# EAGLE design LEDControlSchaltPlan (EAGLE 8.6.0)
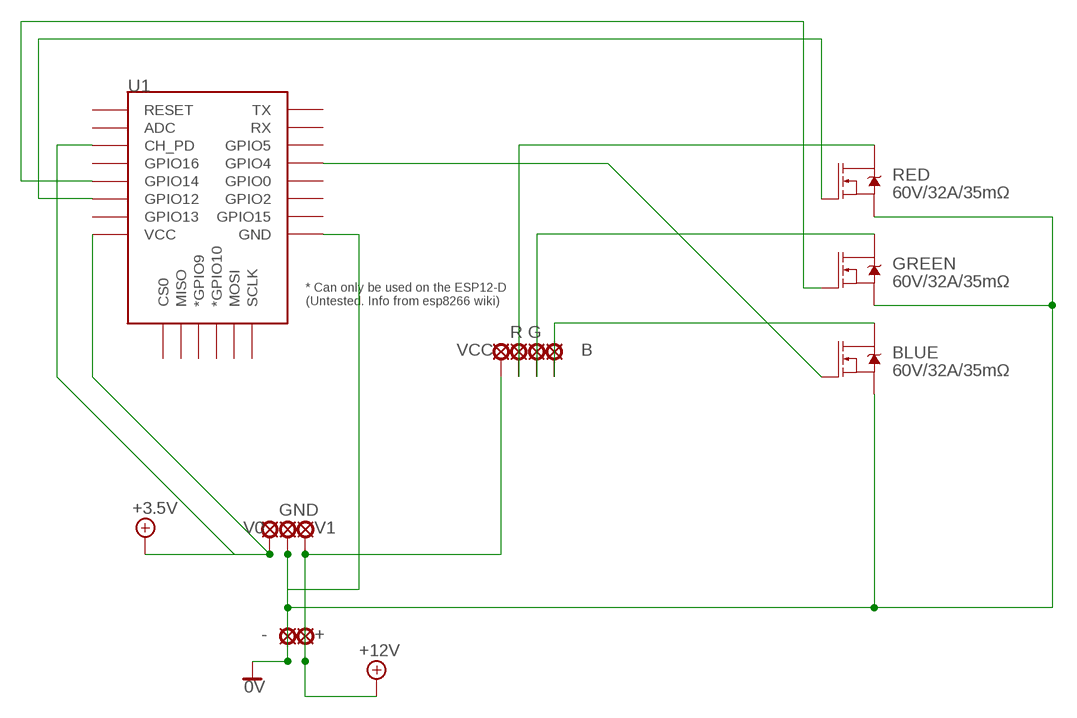
[diagram p0: schematic, sheet 1]

## Parts
+  LSP10  [LSP10]
-  LSP10  [LSP10]
B  LSP10  [LSP10]
BLUE  60V/32A/35mΩ  MOSFET-NCH-FQP30N06L  [TO220V]
G  LSP10  [LSP10]
GND  LSP10  [LSP10]
GREEN  60V/32A/35mΩ  MOSFET-NCH-FQP30N06L  [TO220V]
R  LSP10  [LSP10]
RED  60V/32A/35mΩ  MOSFET-NCH-FQP30N06L  [TO220V]
U1  ESP12ESMD  [ESP12E-SMD]
V0  LSP10  [LSP10]
V1  LSP10  [LSP10]
VCC  LSP10  [LSP10]

## Nets
0V: -.MP BLUE.3(S) GND.MP GREEN.3(S) RED.3(S) U1.GND
+5V: U1.CH_PD U1.VCC V0.MP ; supply symbol labelled +3.5V
+12V: +.MP V1.MP VCC.MP
N$3: RED.1(G) U1.GPIO12
N$4: GREEN.1(G) U1.GPIO14
N$5: BLUE.1(G) U1.GPIO4
N$11: R.MP RED.2(D)
N$12: G.MP GREEN.2(D)
N$13: B.MP BLUE.2(D)
Unconnected: U1.ADC U1.CS0 U1.GPIO0 U1.GPIO2 U1.GPIO5 U1.GPIO9(*GPIO9) U1.GPIO10(*GPIO10) U1.GPIO13 U1.GPIO15 U1.GPIO16 U1.MISO U1.MOSI U1.RESET U1.RXD0(RX) U1.SCLK U1.TXD0(TX)

## Library data of the parts
+ - B G GND R V0 V1 VCC = solpad:LSP10: SOLDER PAD drill 1.0 mm, distributor Buerklin, 12H555
BLUE GREEN RED = SparkFun-DiscreteSemi:MOSFET-NCH: N-channel MOSFETs Voltage controlled devices that allow control of high current outputs. SparkFun Products: SparkFun OpenScale <https://www.sparkfun.com/products/13261> SparkFun Digital Sandbox <https://www.sparkfun.com/products/12651> SparkFun Monster Moto Shield <https://www.sparkfun.com/products/10182> SparkFun MOSFET Power Controller <https://www.sparkfun.com/products/11214>; PROD_ID: TRANS-10060
U1 = esp8266modules:ESP12E: ESP12E Module

## Board
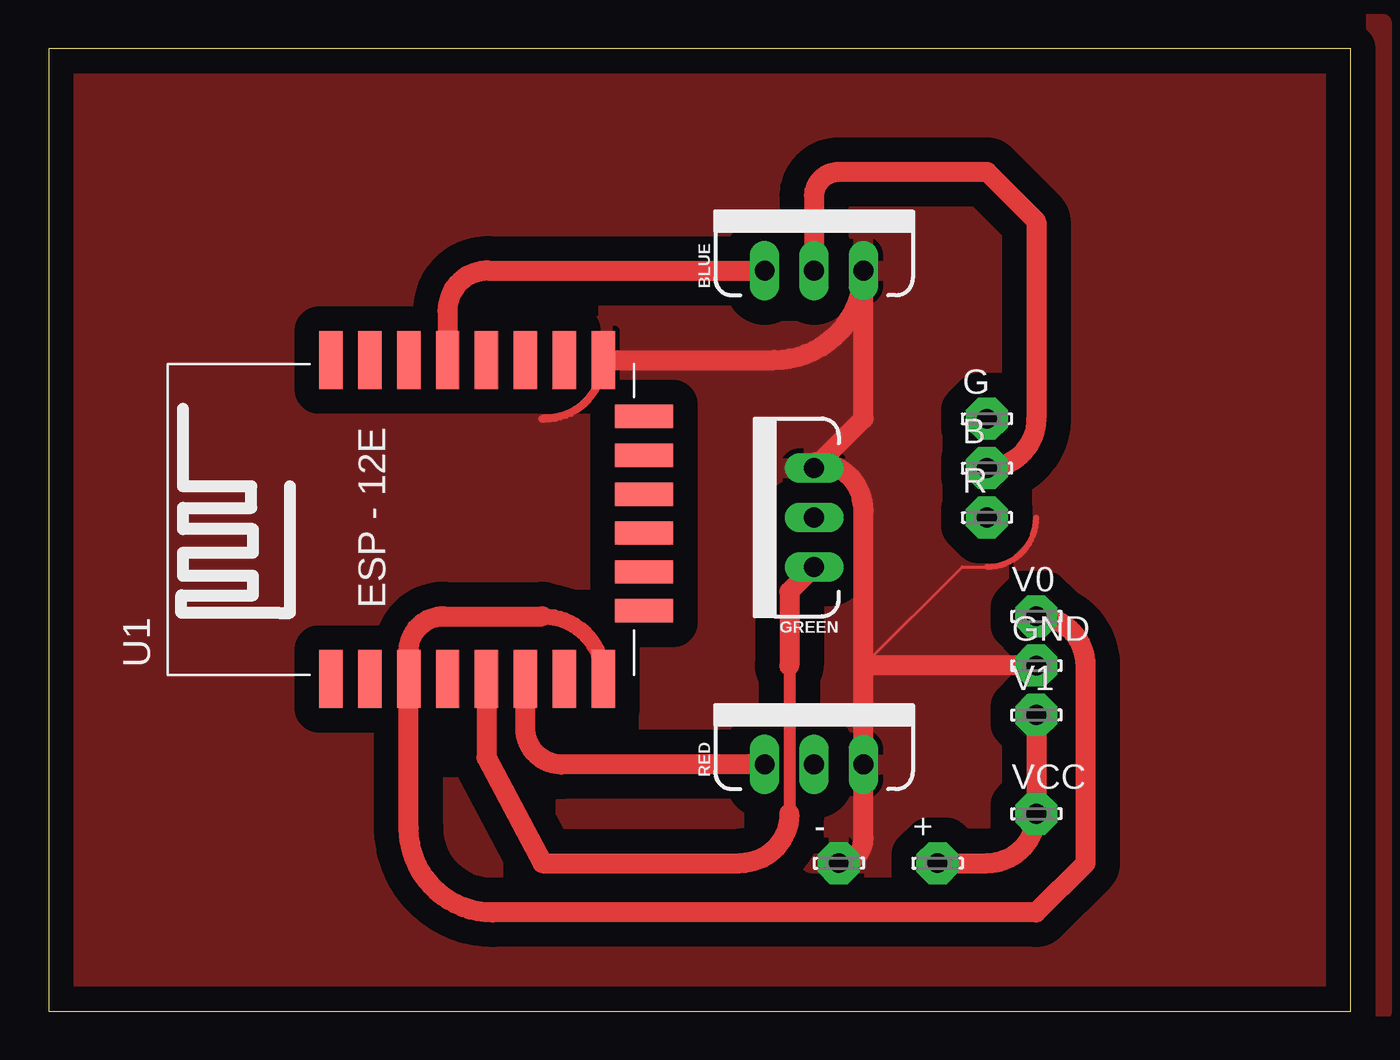
[diagram p1: board, top side]
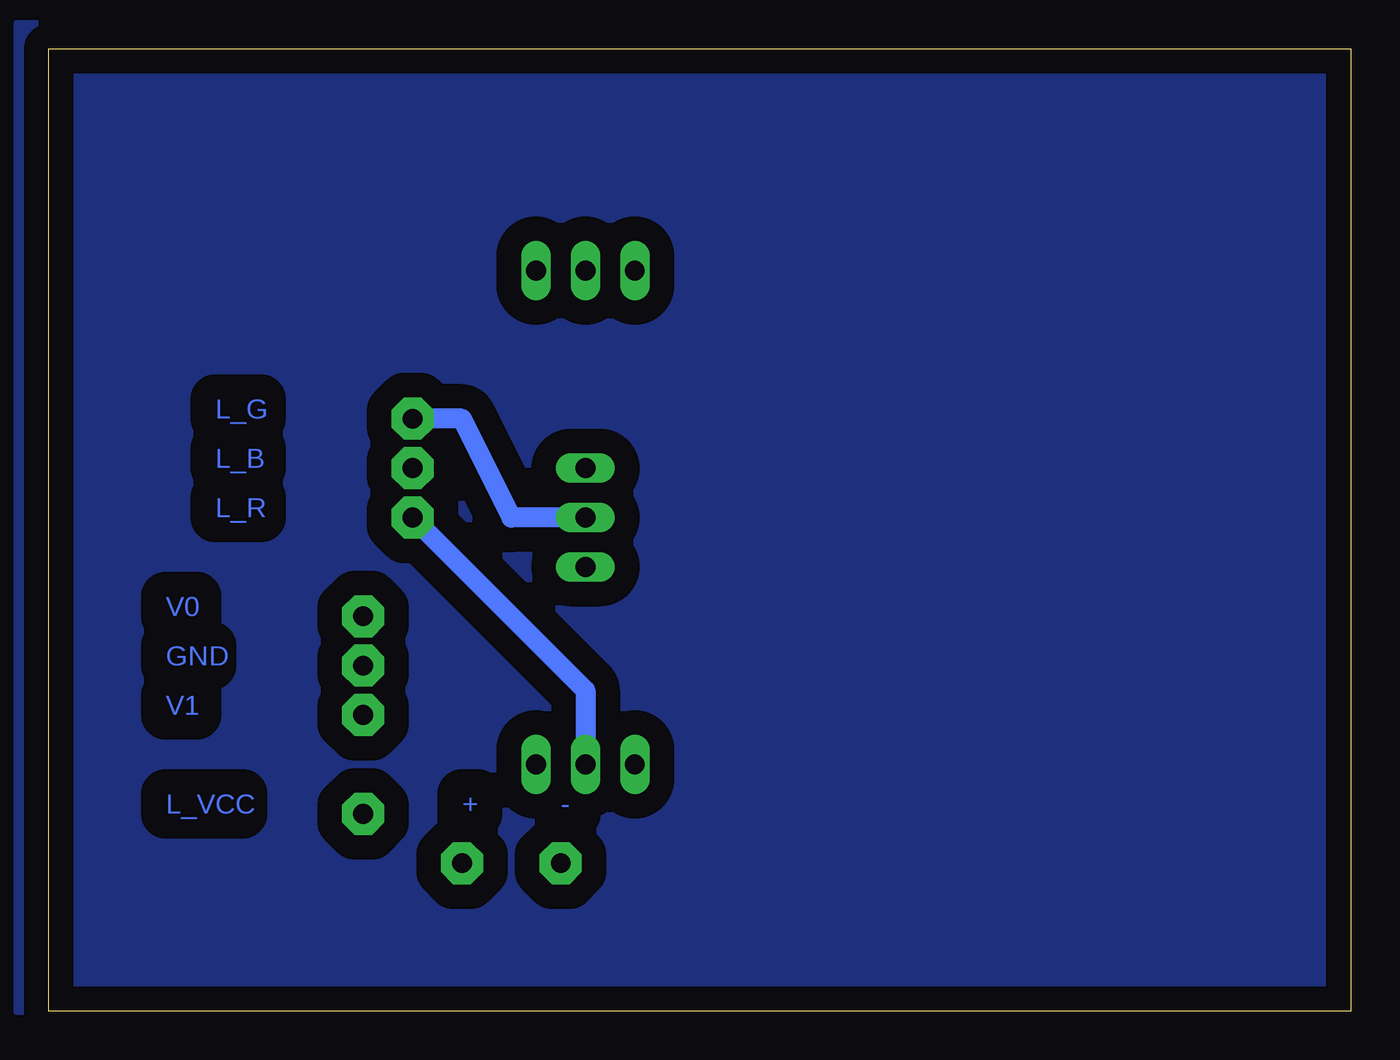
[diagram p2: board, bottom side, seen from below]

Size 66.98 x 49.52 mm. Coordinates in mm from the lower left corner, seen from the top.
Outline: 0,0 66.98,0 66.98,49.52 0,49.52 0,0
Copper layers (1*16): Top 0.035mm / dielectric 1.5mm / Bottom 0.035mm
Design rules "default": minimum track width 6mil, minimum drill 0.35mm, track to track 6mil, track to pad 6mil, pad to pad 6mil, via to via 6mil, smd to smd 6mil, copper to edge 40mil, drill to drill 6mil, minimum pad ring 10mil, minimum via ring 8mil, stop-mask expansion 4mil, vias tented up to drill 0mil, thermal gap 10mil

### Footprints (pad centres in the part's own frame; a part is rotated, then mirrored left to right if it is on the bottom)
LSP10 = drill 1.016 pad 2.159 octagon: MP 0,0
TO220V = drill 1.016 long: 1 -2.54,0; 2 0,0; 3 2.54,0
ESP12E-SMD = smd 3 x 1.2: ADC -8.3,3.8; CH_PD -8.3,1.8; GND 8.1,-8.2; GPIO0 8.1,-2.2; GPIO2 8.1,-4.2; GPIO4 8.1,-0.2; GPIO5 8.1,1.8; GPIO12 -8.3,-4.2; GPIO13 -8.3,-6.2; GPIO14 -8.3,-2.2; GPIO15 8.1,-6.2; GPIO16 -8.3,-0.2; RESET -8.3,5.8; RXD0 8.1,3.8; TXD0 8.1,5.8; VCC -8.3,-8.2 | smd 1.2 x 3: CS0 -4.8,-10.3; GPIO9 -0.8,-10.3; GPIO10 1.2,-10.3; MISO -2.8,-10.3; MOSI 3.2,-10.3; SCLK 5.2,-10.3

### Placement (x,y rotation side)
+  45.72,7.62 0 top
-  40.64,7.62 0 top
B  48.26,27.94 0 top
BLUE  39.37,38.1 0 top
G  48.26,30.48 0 top
GND  50.8,17.78 0 top
GREEN  39.37,25.4 90 top
R  48.26,25.4 0 top
RED  39.37,12.7 0 top
U1  20.32,25.4 90 top
V0  50.8,20.32 0 top
V1  50.8,15.24 0 top
VCC  50.8,10.16 0 top

### Tracks (layer width: path | path; a pad name or v marks a point on that pad's centre or on a via)
0V
  Top 0.152: 41.91,17.78 46.99,22.86 48.26,22.86
  Top 0.305: 48.26,22.86 arc90 50.8,25.4
  Top 0.406: GREEN.3 39.45,28.24 | U1.GND arc-90 25.5,30.48 25.4,30.48
  Top 1.016: U1.GND 37.31,33.5 arc90 BLUE.3 41.91,30.48 GREEN.3 | 41.91,17.78 RED.3 41.91,8.89 arc-90 -.MP | 41.91,17.78 41.91,25.77 arc90 39.45,28.24 | GND.MP 41.91,17.78
  pour Top (isolate 1.27): 0,50.8 68.58,50.8 68.58,0 0,0
+5V
  Top 0.406: 18.52,18.52 U1.CH_PD
  Top 0.813: 25.4,20.32 arc-90 28.52,17.2
  Top 1.016: 18.52,18.52 arc-90 20.32,20.32 25.4,20.32 | V0.MP arc-90 53.34,17.78 53.34,7.62 50.8,5.08 22.86,5.08 arc-90 18.52,9.42 U1.CH_PD | 28.52,17.2 U1.VCC
+12V
  Top 1.016: V1.MP VCC.MP arc-90 48.26,7.62 +.MP
N$1
  pour Bottom (isolate 1.27): 0,50.8 0,0 68.58,0 68.58,50.8
N$3
  Top 1.016: RED.1 26.38,12.7 arc-90 24.52,14.56 U1.GPIO12
N$4
  Top 0.61: 38.1,17.78 38.1,10.16
  Top 1.016: GREEN.1 38.1,21.59 38.1,17.78 | U1.GPIO14 22.52,13.04 25.4,7.62 35.56,7.62 arc90 38.1,10.16
N$5
  Top 1.016: BLUE.1 22.58,38.1 arc90 20.52,36.04 U1.GPIO4
N$11
  Bottom 1.016: R.MP 39.37,16.51 RED.2
N$12
  Bottom 1.016: GREEN.2 43.18,25.4 45.72,30.48 G.MP
N$13
  Top 1.016: BLUE.2 39.37,41.91 arc-90 40.64,43.18 48.26,43.18 50.8,40.64 50.8,30.48 arc-90 B.MP

### Text on the board
Bottom: L_G | L_B | L_R | V0 | GND | V1 | - | + | L_VCC